# Altium schematic sheet arm.SchDoc
size A3
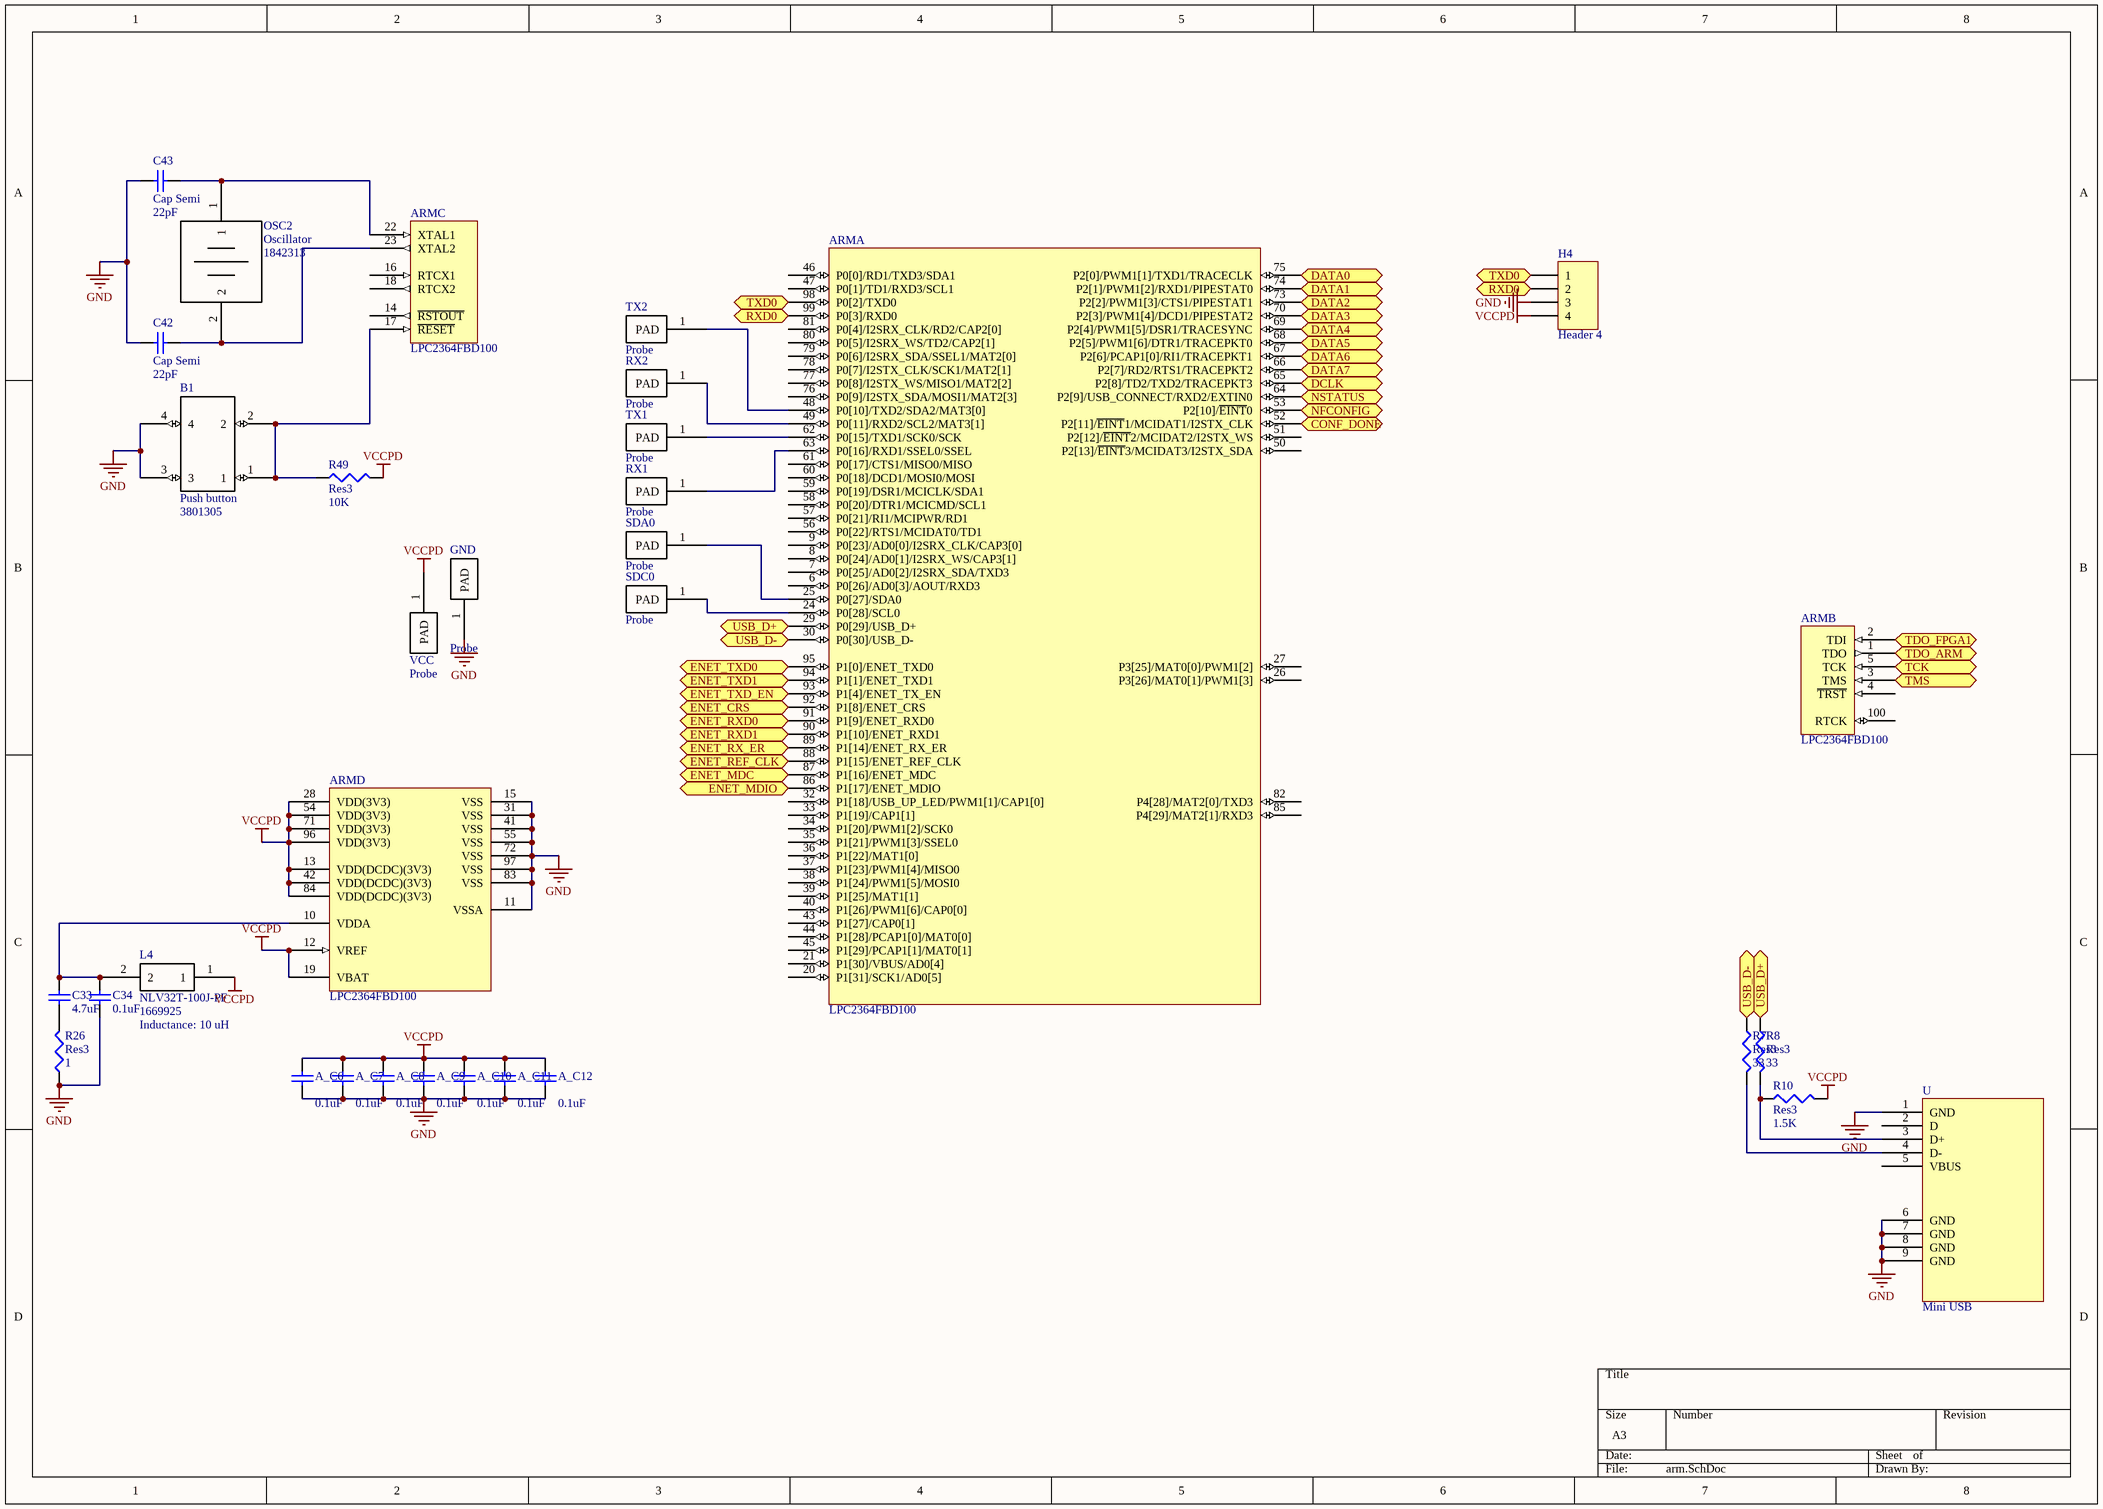
[diagram p0: arm.SchDoc]

## Parts
A_C6  value 0.1uF  [CAPC1608L]  (hidden comment: Cap Semi)
A_C7  value 0.1uF  [CAPC1608L]  (hidden comment: Cap Semi)
A_C8  value 0.1uF  [CAPC1608L]  (hidden comment: Cap Semi)
A_C9  value 0.1uF  [CAPC1608L]  (hidden comment: Cap Semi)
A_C10  value 0.1uF  [CAPC1608L]  (hidden comment: Cap Semi)
A_C11  value 0.1uF  [CAPC1608L]  (hidden comment: Cap Semi)
A_C12  value 0.1uF  [CAPC1608L]  (hidden comment: Cap Semi)
ARM  LPC2364FBD100  [SOT407-1_N]  (parts A,B,C,D of 4)
B1  Push button  Supplier Part Number 1: 3801305  [SMD Button]
C33  value 4.7uF  [CAPC1608L]  (hidden comment: Cap Semi)
C34  value 0.1uF  [CAPC1608L]  (hidden comment: Cap Semi)
C42  Cap Semi  value 22pF  [CAPC1608L]
C43  Cap Semi  value 22pF  [CAPC1608L]
GND  Probe  [Probe pad]
H4  Header 4  [HDR1X4]
L4  NLV32T-100J-PF  Supplier Part Number 1: 1669925  Inductance: 10 uH  [INDC3225X22N]
OSC2  Oscillator  Supplier Part Number 1: 1842313  [HC49/4H_SMX]
R7  Res3  value 33  [RESC1608L]
R8  Res3  value 33  [RESC1608L]
R10  Res3  value 1.5K  [RESC1608L]
R26  Res3  value 1  [RESC1608L]
R49  Res3  value 10K  [RESC1608L]
RX1  Probe  [Probe pad]
RX2  Probe  [Probe pad]
SDA0  Probe  [Probe pad]
SDC0  Probe  [Probe pad]
TX1  Probe  [Probe pad]
TX2  Probe  [Probe pad]
U  Mini USB  [Mini USB B]
VCC  Probe  [Probe pad]

## Ports
CONF_DONE, DATA0, DATA1, DATA2, DATA3, DATA4, DATA5, DATA6, DATA7, DCLK, ENET_CRS, ENET_MDC, ENET_MDIO, ENET_REF_CLK, ENET_RX_ER, ENET_RXD0, ENET_RXD1, ENET_TXD0, ENET_TXD1, ENET_TXD_EN, NFCONFIG, NSTATUS, RXD0, TCK, TDO_ARM, TDO_FPGA1, TMS, TXD0, USB_D+, USB_D-

## Nets
GND: A_C6.2 A_C7.2 A_C8.2 A_C9.2 A_C10.2 A_C11.2 A_C12.2 ARM.11(VSSA) ARM.15(VSS) ARM.31(VSS) ARM.41(VSS) ARM.55(VSS) ARM.72(VSS) ARM.83(VSS) ARM.97(VSS) B1.3 B1.4 C34.2 C42.1 C43.1 GND.1(PAD) H4.3 R26.1 U.1(GND) U.6(GND) U.7(GND) U.8(GND) U.9(GND)
VCCPD: A_C6.1 A_C7.1 A_C8.1 A_C9.1 A_C10.1 A_C11.1 A_C12.1 ARM.12(VREF) ARM.13(VDD(DCDC)(3V3)) ARM.19(VBAT) ARM.28(VDD(3V3)) ARM.42(VDD(DCDC)(3V3)) ARM.54(VDD(3V3)) ARM.71(VDD(3V3)) ARM.84(VDD(DCDC)(3V3)) ARM.96(VDD(3V3)) H4.4 L4.1 R10.2 R49.2 VCC.1(PAD)
CONF_DONE: ARM.52(P2[11]/~{EINT}1/MCIDAT1/I2STX_CLK) ; port CONF_DONE
DATA0: ARM.75(P2[0]/PWM1[1]/TXD1/TRACECLK) ; port DATA0
DATA1: ARM.74(P2[1]/PWM1[2]/RXD1/PIPESTAT0) ; port DATA1
DATA2: ARM.73(P2[2]/PWM1[3]/CTS1/PIPESTAT1) ; port DATA2
DATA3: ARM.70(P2[3]/PWM1[4]/DCD1/PIPESTAT2) ; port DATA3
DATA4: ARM.69(P2[4]/PWM1[5]/DSR1/TRACESYNC) ; port DATA4
DATA5: ARM.68(P2[5]/PWM1[6]/DTR1/TRACEPKT0) ; port DATA5
DATA6: ARM.67(P2[6]/PCAP1[0]/RI1/TRACEPKT1) ; port DATA6
DATA7: ARM.66(P2[7]/RD2/RTS1/TRACEPKT2) ; port DATA7
DCLK: ARM.65(P2[8]/TD2/TXD2/TRACEPKT3) ; port DCLK
ENET_CRS: ARM.92(P1[8]/ENET_CRS) ; port ENET_CRS
ENET_MDC: ARM.87(P1[16]/ENET_MDC) ; port ENET_MDC
ENET_MDIO: ARM.86(P1[17]/ENET_MDIO) ; port ENET_MDIO
ENET_REF_CLK: ARM.88(P1[15]/ENET_REF_CLK) ; port ENET_REF_CLK
ENET_RX_ER: ARM.89(P1[14]/ENET_RX_ER) ; port ENET_RX_ER
ENET_RXD0: ARM.91(P1[9]/ENET_RXD0) ; port ENET_RXD0
ENET_RXD1: ARM.90(P1[10]/ENET_RXD1) ; port ENET_RXD1
ENET_TXD0: ARM.95(P1[0]/ENET_TXD0) ; port ENET_TXD0
ENET_TXD1: ARM.94(P1[1]/ENET_TXD1) ; port ENET_TXD1
ENET_TXD_EN: ARM.93(P1[4]/ENET_TX_EN) ; port ENET_TXD_EN
NFCONFIG: ARM.53(P2[10]/~{EINT}0) ; port NFCONFIG
NSTATUS: ARM.64(P2[9]/USB_CONNECT/RXD2/EXTIN0) ; port NSTATUS
RXD0: ARM.99(P0[3]/RXD0) H4.2 ; port RXD0
TCK: ARM.5(TCK) ; port TCK
TDO_ARM: ARM.1(TDO) ; port TDO_ARM
TDO_FPGA1: ARM.2(TDI) ; port TDO_FPGA1
TMS: ARM.3(TMS) ; port TMS
TXD0: ARM.98(P0[2]/TXD0) H4.1 ; port TXD0
USB_D+: ARM.29(P0[29]/USB_D+) R8.1 ; port USB_D+
USB_D-: ARM.30(P0[30]/USB_D-) R7.1 ; port USB_D-
NetARM_10: ARM.10(VDDA) C33.1 C34.1 L4.2
NetARM_17: ARM.17(~{RESET}) B1.1 B1.2 R49.1
NetARM_22: ARM.22(XTAL1) C43.2 OSC2.1
NetARM_23: ARM.23(XTAL2) C42.2 OSC2.2
NetARM_24: ARM.24(P0[28]/SCL0) SDC0.1(PAD)
NetARM_25: ARM.25(P0[27]/SDA0) SDA0.1(PAD)
NetARM_48: ARM.48(P0[10]/TXD2/SDA2/MAT3[0]) TX2.1(PAD)
NetARM_49: ARM.49(P0[11]/RXD2/SCL2/MAT3[1]) RX2.1(PAD)
NetARM_62: ARM.62(P0[15]/TXD1/SCK0/SCK) TX1.1(PAD)
NetARM_63: ARM.63(P0[16]/RXD1/SSEL0/SSEL) RX1.1(PAD)
NetC33_2: C33.2 R26.2
NetR7_2: R7.2 U.4(D-)
NetR8_2: R8.2 R10.1 U.3(D+)

Not connected (* = marked no-connect by the designer): ARM 4(~{TRST}) 6(P0[26]/AD0[3]/AOUT/RXD3) 7(P0[25]/AD0[2]/I2SRX_SDA/TXD3) 8(P0[24]/AD0[1]/I2SRX_WS/CAP3[1]) 9(P0[23]/AD0[0]/I2SRX_CLK/CAP3[0]) 14(~{RSTOUT}) 16(RTCX1) 18(RTCX2) 20(P1[31]/SCK1/AD0[5]) 21(P1[30]/VBUS/AD0[4]) 26(P3[26]/MAT0[1]/PWM1[3]) 27(P3[25]/MAT0[0]/PWM1[2]) 32(P1[18]/USB_UP_LED/PWM1[1]/CAP1[0]) 33(P1[19]/CAP1[1]) 34(P1[20]/PWM1[2]/SCK0) 35(P1[21]/PWM1[3]/SSEL0) 36(P1[22]/MAT1[0]) 37(P1[23]/PWM1[4]/MISO0) 38(P1[24]/PWM1[5]/MOSI0) 39(P1[25]/MAT1[1]) 40(P1[26]/PWM1[6]/CAP0[0]) 43(P1[27]/CAP0[1]) 44(P1[28]/PCAP1[0]/MAT0[0]) 45(P1[29]/PCAP1[1]/MAT0[1]) 46(P0[0]/RD1/TXD3/SDA1) 47(P0[1]/TD1/RXD3/SCL1) 50(P2[13]/~{EINT}3/MCIDAT3/I2STX_SDA) 51(P2[12]/~{EINT}2/MCIDAT2/I2STX_WS) 56(P0[22]/RTS1/MCIDAT0/TD1) 57(P0[21]/RI1/MCIPWR/RD1) 58(P0[20]/DTR1/MCICMD/SCL1) 59(P0[19]/DSR1/MCICLK/SDA1) 60(P0[18]/DCD1/MOSI0/MOSI) 61(P0[17]/CTS1/MISO0/MISO) 76(P0[9]/I2STX_SDA/MOSI1/MAT2[3]) 77(P0[8]/I2STX_WS/MISO1/MAT2[2]) 78(P0[7]/I2STX_CLK/SCK1/MAT2[1]) 79(P0[6]/I2SRX_SDA/SSEL1/MAT2[0]) 80(P0[5]/I2SRX_WS/TD2/CAP2[1]) 81(P0[4]/I2SRX_CLK/RD2/CAP2[0]) 82(P4[28]/MAT2[0]/TXD3) 85(P4[29]/MAT2[1]/RXD3) 100(RTCK); U 2(D) 5(VBUS)

## Library data of the parts
A_C6-A_C12 C33 C34 C42 C43 = Cap Semi: Capacitor (Semiconductor SIM Model); Published: 8-Jun-2000; LatestRevisionDate: 29-May-2009; LatestRevisionNote: IPC-7351 Footprint Added.; PackageReference: C1206; Publisher: Altium Limited; PackageDescription: Chip Capacitor
ARM = LPC2364FBD100: ARM7 16/32-Bit Microcontroller, 128KB Flash, 34KB RAM, 4 Channel CAN, 100-Lead LQFP; Code_IEC: 136E20; Published: 17-Aug-2007; DatasheetVersion: rev.01, Jan-2007; PackageVersion: Feb-2003; PackageReference: SOT407-1; Publisher: Altium Limited; PackageDescription: 100-Pin Plastic Low Profile Quad Flat Pack, LQFP100; Code_JEDEC: MS-026; ComponentLink1Description: Manufacturer Link; ComponentLink1URL: http://www.nxp.com/; ComponentLink2Description: Datasheet; ComponentLink2URL: http://www.standardics.nxp.com/products/lpc2000/datasheet/lpc2364.lpc2366.lpc2368.pdf
H4 = Header 4: Header, 4-Pin; LatestRevisionDate: 17-Jul-2002; LatestRevisionNote: Re-released for DXP Platform.; Publisher: Altium Limited
L4 = NLV32T-100J-PF: Current rating: 150 mA; Supplier 1: Farnell
OSC2 = Oscillator: Frequency: 25MHZ; Supplier 1: Farnell
R7 R8 R10 R26 R49 = Res3: Resistor; Published: 8-Jun-2000; LatestRevisionDate: 29-May-2009; LatestRevisionNote: IPC-7351 Footprint Added.; PackageReference: J1-0603; Publisher: Altium Limited; PackageDescription: Chip Resistor
B1 = Push button: Supplier 1: Farnell